# Altium schematic sheet DSO_Trig.SchDoc: Schematic_Name
size A4; CompanyName: University of Melbourne; Engineer: Your Name Here; DocumentNumber: 1; Revision: 0.1; SheetNumber: 1; SheetTotal: 1; Title_Project: Project_Title; StudentNo: Student No.
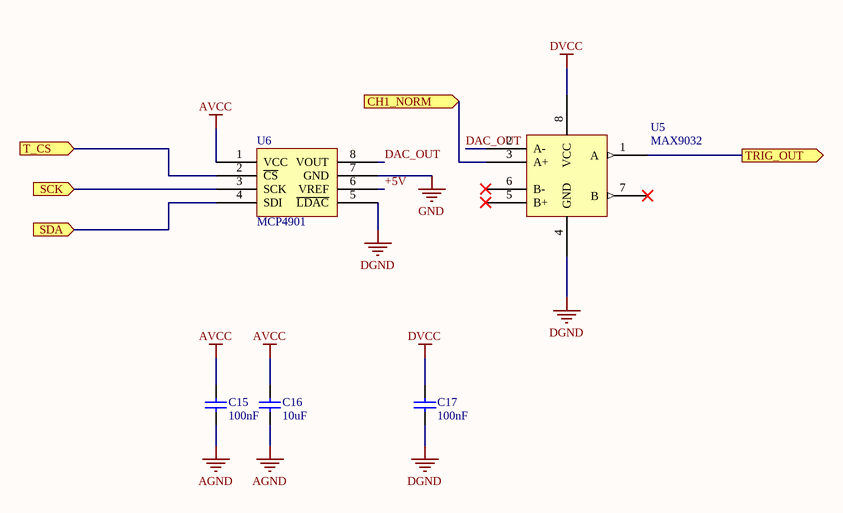
[diagram p0: DSO_Trig.SchDoc]

## Parts
C15  100nF  [0805C]
C16  10uF  [0805C]
C17  100nF  [0805C]
U5  MAX9032  [SOIC-8]
U6  MCP4901  [SOIC-8]

## Ports
CH1_NORM (in), SCK (in), SDA (in), T_CS (in), TRIG_OUT (out)

## Nets
AGND: C15.2 C16.2
AVCC: C15.1 C16.1 U6.1(VCC)
DGND: C17.2 U5.4(GND) U6.5(~{LDAC})
DVCC: C17.1 U5.8(VCC)
GND: U6.7(GND)
+5V: U6.6(VREF)
CH1_NORM: U5.3(A+) ; port CH1_NORM
DAC_OUT: U5.2(A-) U6.8(VOUT)
SCK: U6.3(SCK) ; port SCK
SDA: U6.4(SDI) ; port SDA
T_CS: U6.2(~{CS}) ; port T_CS
TRIG_OUT: U5.1(A) ; port TRIG_OUT

Not connected (* = marked no-connect by the designer): U5 5(B+)* 6(B-)* 7(B)*

## Library data of the parts
C15-C17 = C: Capacitor; Reviewed by: RM - 2018/08/05; Revision: July-2002: Re-released for DXP Platform.; Supplier 1: *; Supplier Part Number 1: *
  C15 C17: Value: 100nF
  C16: Value: 10uF
U5 = MAX9032: Dual Comparator; Reviewed by: RM - 2018/08/05; Supplier 1: Digi-Key; Supplier Part Number 1: MAX9032ASA-ND
U6 = MCP4901: DAC 8bit SPI; Reviewed by: RM - 2018/08/05; Supplier 1: Digi-Key; Supplier Part Number 1: MCP4901-E/SN-ND